# EAGLE design X15-DataConversion (EAGLE 9.6.2)
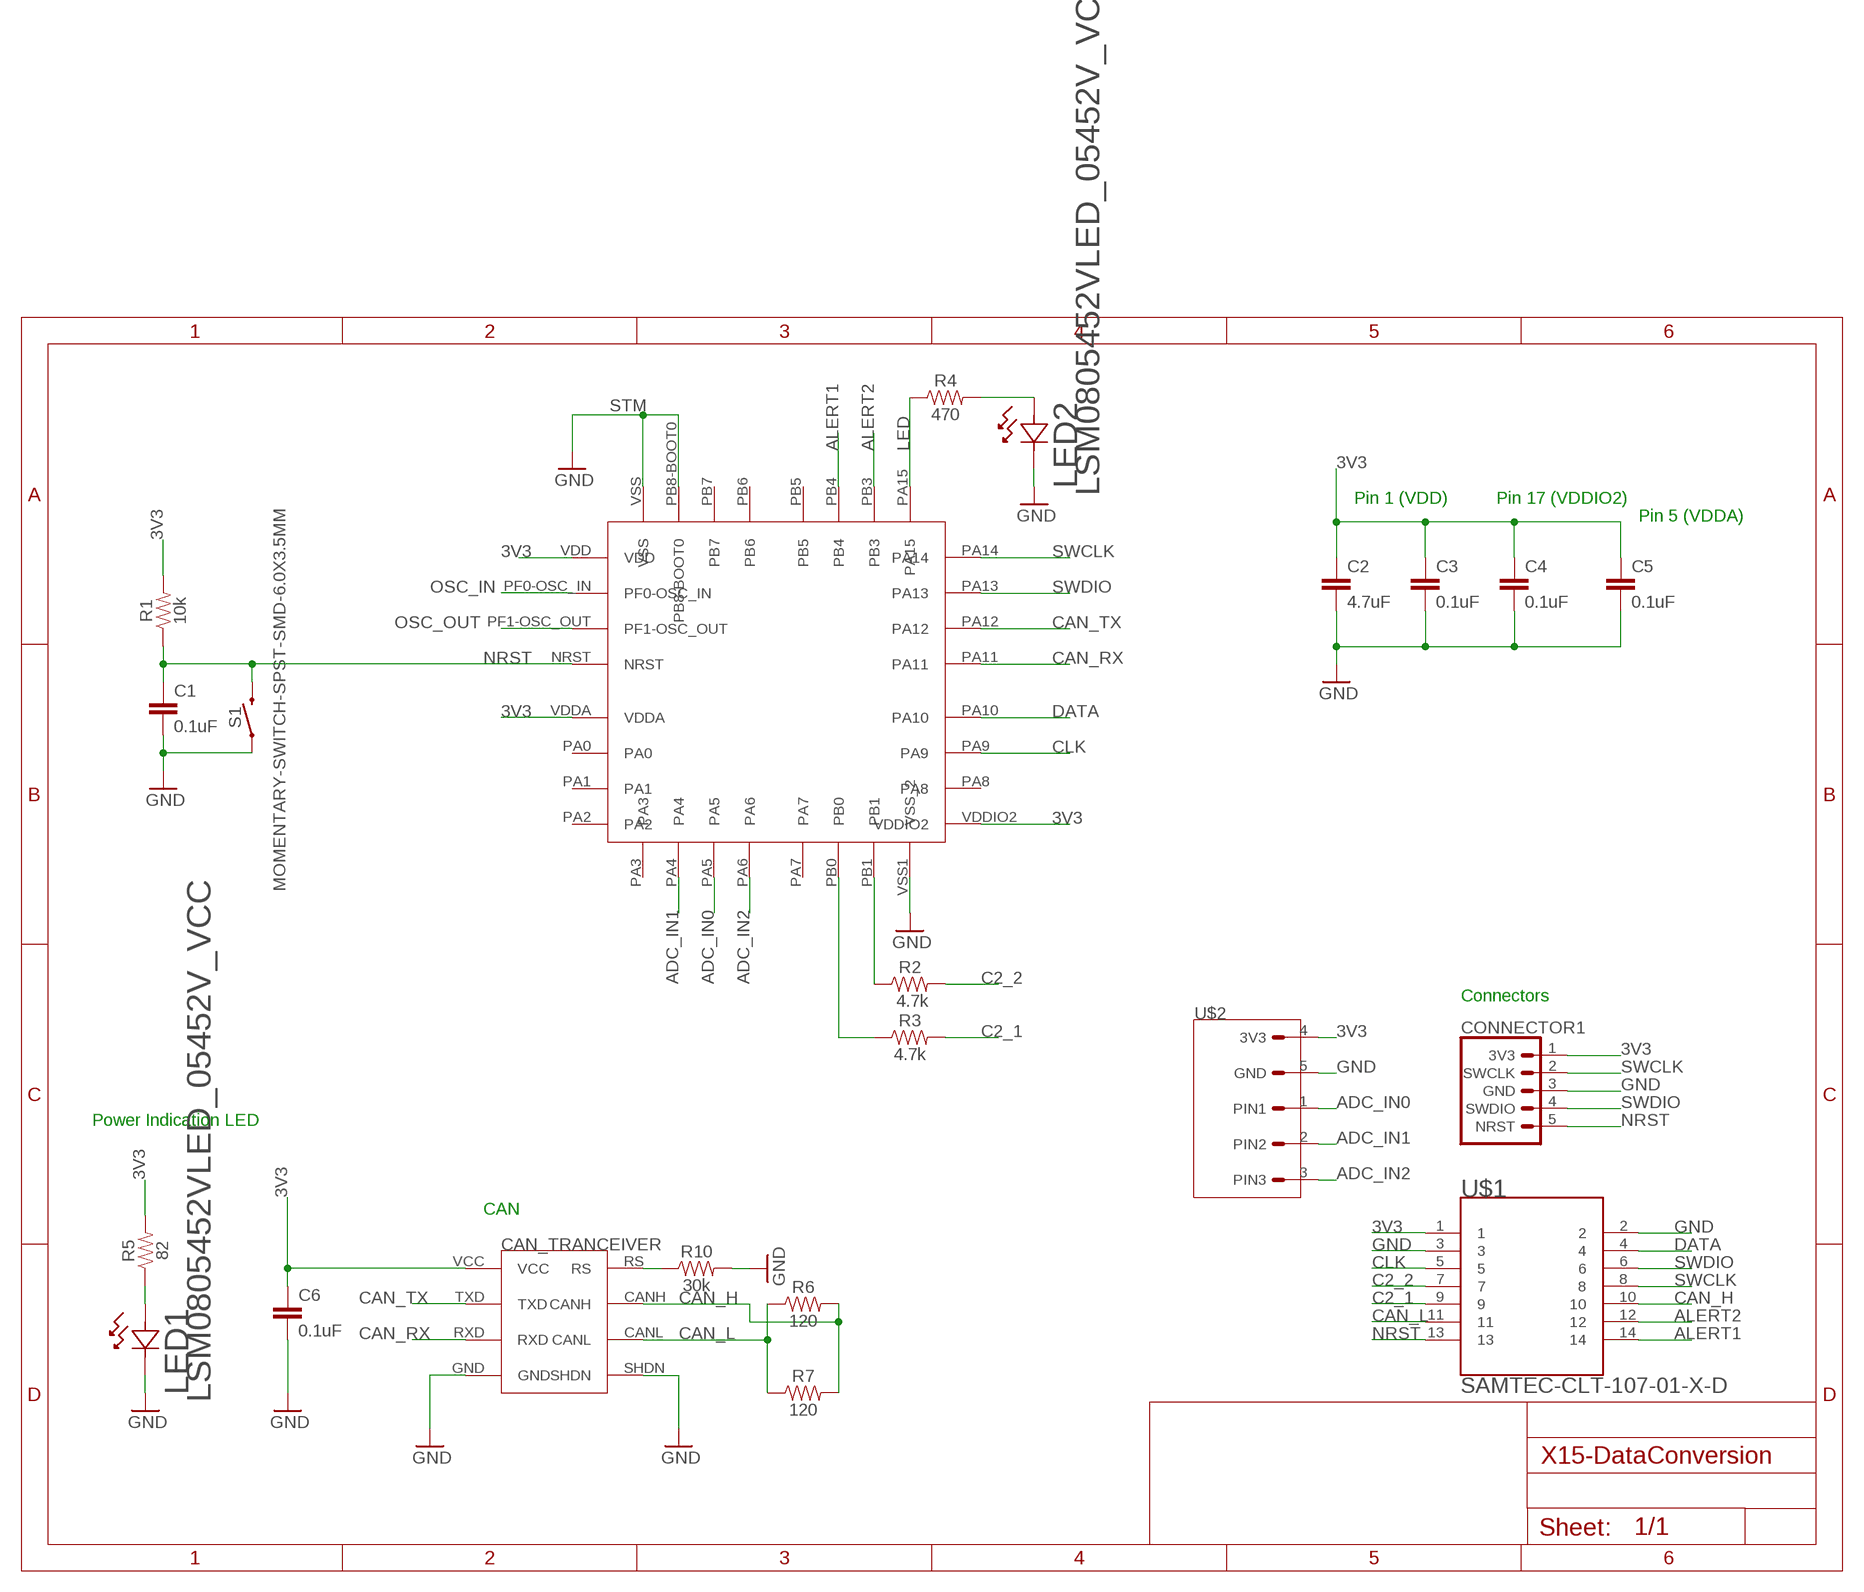
[diagram p0: schematic, sheet 1]

## Parts
C1  0.1uF  0.1UF-0603-25V-5%  [0603]
C2  4.7uF  0.1UF-0603-25V-5%  [0603]
C3  0.1uF  0.1UF-0603-25V-5%  [0603]
C4  0.1uF  0.1UF-0603-25V-5%  [0603]
C5  0.1uF  0.1UF-0603-25V-5%  [0603]
C6  0.1uF  0.1UF-0603-25V-5%  [0603]
CAN_TRANCEIVER  MAX3058ASA+  [MAX3058ASA+]
CONNECTOR1  3V3 -SWCLK-GND-SWDIO- NRST  SWD_CONN  [1X05]
LED1  LSM0805452VLED_05452V_VCC  [LED_05452V_VCC]
LED2  LSM0805452VLED_05452V_VCC  [LED_05452V_VCC]
R1  10k  RESISTOR0603  [0603]
R2  4.7k  RESISTOR0603  [0603]
R3  4.7k  RESISTOR0603  [0603]
R4  470  RESISTOR0603  [0603]
R5  82  RESISTOR0603  [0603]
R6  120  RESISTOR0603  [0603]
R7  120  RESISTOR0603  [0603]
R10  30k  RESISTOR0603  [0603]
S1  MOMENTARY-SWITCH-SPST-SMD-6.0X3.5MM  [TACTILE_SWITCH_SMD_6.0X3.5MM]
STM  STM32F042K6T6  [STM32F042K6T6]
U$1  BACKPLANE->DATACONV  [SAMTEC-CLT-107-01-X-D-BACKPLANE]
U$2  STM_CONN  [1X05]

## Nets
3V3: C2.1 C3.1 C4.1 C5.1 C6.1 CAN_TRANCEIVER.VCC CONNECTOR1.1(3V3) R1.2 R5.2 STM.VDD STM.VDDA STM.VDDIO2 U$1.1 U$2.4(3V3)
ADC_IN0: STM.PA5 U$2.1(PIN1)
ADC_IN1: STM.PA4 U$2.2(PIN2)
ADC_IN2: STM.PA6 U$2.3(PIN3)
ALERT1: STM.PB4 U$1.14
ALERT2: STM.PB3 U$1.12
C2_1: R3.2 U$1.9
C2_2: R2.2 U$1.7
CAN_H: CAN_TRANCEIVER.CANH R6.2 R7.2 U$1.10
CAN_L: CAN_TRANCEIVER.CANL R6.1 R7.1 U$1.11
CAN_RX: CAN_TRANCEIVER.RXD STM.PA11
CAN_TX: CAN_TRANCEIVER.TXD STM.PA12
CLK: STM.PA9 U$1.5
DATA: STM.PA10 U$1.4
GND: C1.2 C2.2 C3.2 C4.2 C5.2 C6.2 CAN_TRANCEIVER.GND CAN_TRANCEIVER.SHDN CONNECTOR1.3(GND) LED1.2 LED2.2 R10.2 S1.1 STM.PB8-BOOT0 STM.VSS STM.VSS1(VSS_2) U$1.2 U$1.3 U$2.5(GND)
LED: R4.1 STM.PA15
N$1: LED1.1 R5.1
N$2: CAN_TRANCEIVER.RS R10.1
N$6: R2.1 STM.PB1
N$7: R3.1 STM.PB0
N$11: LED2.1 R4.2
NRST: C1.1 CONNECTOR1.5(NRST) R1.1 S1.2 STM.NRST U$1.13
OSC_IN: STM.PF0-OSC_IN
OSC_OUT: STM.PF1-OSC_OUT
SWCLK: CONNECTOR1.2(SWCLK) STM.PA14 U$1.8
SWDIO: CONNECTOR1.4(SWDIO) STM.PA13 U$1.6
Unconnected: STM.PA0 STM.PA1 STM.PA2 STM.PA3 STM.PA7 STM.PA8 STM.PB5 STM.PB6 STM.PB7

## Notes on the sheet
- Pin 1 (VDD) | Pin 17 (VDDIO2)
- Pin 5 (VDDA)
- Connectors
- Power Indication LED
- CAN

## Library data of the parts
C1 C3-C6 = SparkFun-RF:0.1UF: 0.1µF ceramic capacitors A capacitor is a passive two-terminal electrical component used to store electrical energy temporarily in an electric field.; PROD_ID: CAP-08604
C2 = SparkFun-RF:0.1UF: 0.1µF ceramic capacitors A capacitor is a passive two-terminal electrical component used to store electrical energy temporarily in an electric field.; PROD_ID: CAP-08604; VALUE: 0.1uF
CAN_TRANCEIVER = X15-Data-Conversion-Parts:MAX3058ASA+
CONNECTOR1 = X15-Data-Conversion-Parts:SWD_CONN
LED1 LED2 = X15-Data-Conversion-Parts:LSM0805452V; COPYRIGHT: Copyright (C) 2022 Ultra Librarian. All rights reserved.; DIGI-KEY_PART_NUMBER_1: 28-LSM0805452VTR-ND; DIGI-KEY_PART_NUMBER_2: 28-LSM0805452VCT-ND; DIGI-KEY_PART_NUMBER_3: 28-LSM0805452VDKR-ND; MANUFACTURER_PART_NUMBER: LSM0805452V; MFR_NAME: VCC
R1-R7 R10 = SparkFun-Resistors:RESISTOR: Generic Resistor Package
S1 = SparkFun-Switches:MOMENTARY-SWITCH-SPST: Momentary Switch (Pushbutton) - SPST Normally-open (NO) SPST momentary switches (buttons, pushbuttons). Variants PTH-12MM - 12mm square, through-hole Momentary Pushbutton Switch - 12mm Square <https://www.sparkfun.com/products/9190> (COM-09190) PTH-6.0MM, PTH-6.0MM-KIT - 6.0mm square, through-hole Mini Pushbutton Switch <https://www.sparkfun.com/products/97> (COM-00097) KIT package intended for soldering kit's - only one side of pads' copper is exposed. PTH-RIGHT-ANGLE-KIT - Right-angle, through-hole Right Angle Tactile Button <https://www.sparkfun.com/products/10791> - Used on SparkFun BigTime Watch Kit <https://www.sparkfun.com/products/11734> SMD-12MM - 12mm square, surface-mount Tactile Button - SMD (12mm) <https://www.sparkfun.com/products/12993> (COM-12993) Used on SparkFun PicoBoard <https://www.sparkfun.com/products/11888> SMD-4.5MM - 4.5mm Square Trackball Switch Used on SparkFun Blackberry Trackballer Breakout <https://www.sparkfun.com/products/13169> SMD-4.6MMX2.8MM - 4.60mm x 2.80mm, surface mount Used on SparkFun Pro Micro - RP2040 <https://www.sparkfun.com/products/17717> SMD-5.2MM, SMD-5.2-REDUNDANT - 5.2mm square, surface-mount Mini Pushbutton Switch - SMD <https://www.sparkfun.com/products/8720> (COM-08720) Used on Arduino Pro Mini <https://www.sparkfun.com/products/11114> REDUNDANT package connects both switch circuits together SMD-6.0X3.5MM - 6.0 x 3.5mm, surface mount Momentary Reset Switch SMD <https://www.sparkfun.com/products/8229> (COM-08229) SMD-6.2MM-TALL - 6.2mm square, surface mount Tactile Button - SMD (6mm) <https://www.sparkfun.com/products/12992> Used on SparkFun Digital Sandbox <https://www.sparkfun.com/products/12651> SMD-RIGHT-ANGLE - Right-angle, surface mount Used on SparkFun Block for Intel® Edison - Arduino <https://www.sparkfun.com/products/13036>; PROD_ID: SWCH-14278; SF_SKU: COM-08229
STM = X15-Data-Conversion-Parts:STM32F042K6T6
U$1 = X15-Data-Conversion-Parts:BACKPLANE->DATACONV
U$2 = X15-Data-Conversion-Parts:STM_CONN

## Board
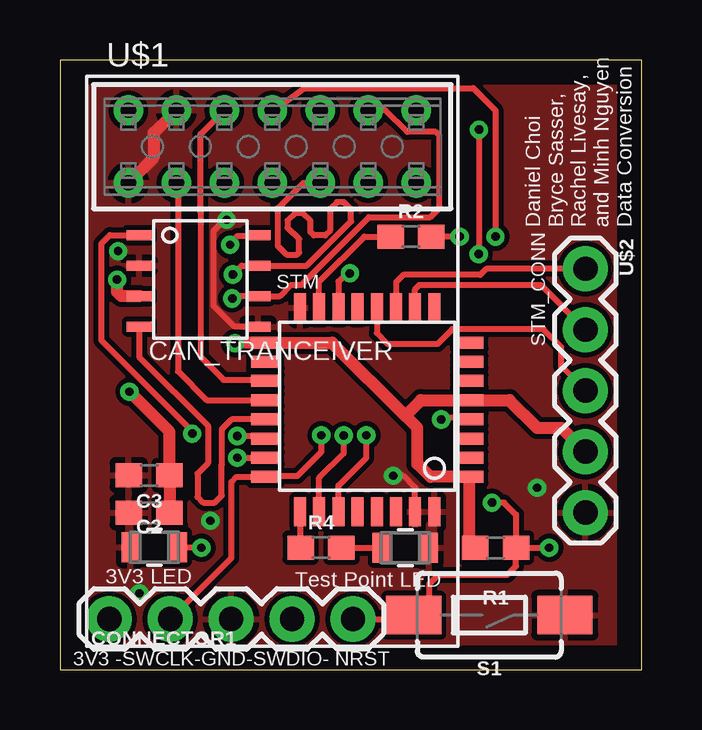
[diagram p1: board, top side]
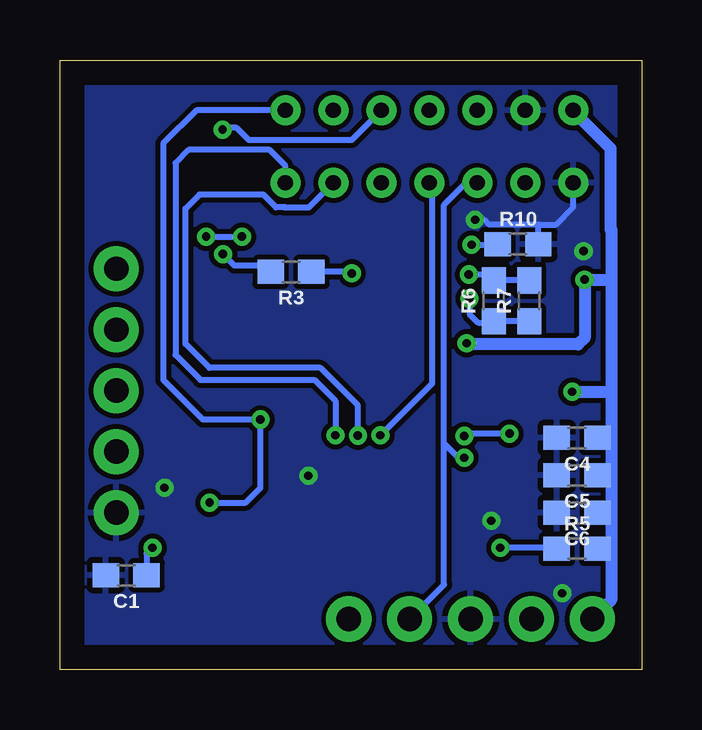
[diagram p2: board, bottom side, seen from below]

Size 24.26 x 25.4 mm. Coordinates in mm from the lower left corner, seen from the top.
Outline: 0,0 24.26,0 24.26,25.4 0,25.4 0,0
Copper layers (1*16): Top 0.035mm / dielectric 1.5mm / Bottom 0.035mm
Design rules "477": minimum track width 6mil, minimum drill 0.35mm, track to track 6mil, track to pad 6mil, pad to pad 6mil, via to via 6mil, smd to smd 6mil, copper to edge 40mil, drill to drill 6mil, minimum pad ring 10mil, minimum via ring 8mil, stop-mask expansion 4mil, vias tented up to drill 0mil, thermal gap 10mil

### Footprints (pad centres in the part's own frame; a part is rotated, then mirrored left to right if it is on the bottom)
0603 = smd 1.1 x 1: 1 -0.85,0; 2 0.85,0
MAX3058ASA+ = smd 1.05 x 0.42: CANH 4.95,-1.27; CANL 4.95,-2.54; GND 0,-1.27; RS 4.95,0; RXD 0,-3.81; SHDN 4.95,-3.81; TXD 0,0; VCC 0,-2.54
1X05 = drill 1.016 pad 1.88: 1 0,0; 2 2.54,0; 3 5.08,0; 4 7.62,0; 5 10.16,0
LED_05452V_VCC = smd 0.762 x 1.245: 1 -0.978,0; 2 0.978,0
TACTILE_SWITCH_SMD_6.0X3.5MM = smd 2.3 x 1.6: 1 -3.15,0; 2 3.15,0
STM32F042K6T6 = smd 1.2 x 0.5: NRST -1.45,4.65; PA0 -1.45,3.05; PA1 -1.45,2.25; PA2 -1.45,1.45; PA8 7.05,2.25; PA9 7.05,3.05; PA10 7.05,3.85; PA11 7.05,4.65; PA12 7.05,5.45; PA13 7.05,6.25; PA14 7.05,7.05; PF0-OSC_IN -1.45,6.25; PF1-OSC_OUT -1.45,5.45; VDD -1.45,7.05; VDDA -1.45,3.85; VDDIO2 7.05,1.45 | smd 0.5 x 1.2: PA3 0,0; PA4 0.8,0; PA5 1.6,0; PA6 2.4,0; PA7 3.2,0; PA15 5.6,8.5; PB0 4,0; PB1 4.8,0; PB3 4.8,8.5; PB4 4,8.5; PB5 3.2,8.5; PB6 2.4,8.5; PB7 1.6,8.5; PB8-BOOT0 0.8,8.5; VSS 5.6,0; VSS1 0,8.5
SAMTEC-CLT-107-01-X-D-BACKPLANE = drill 0.64 pad 1.24: 1 -6,1.511; 2 -6,-1.511; 3 -4,1.511; 4 -4,-1.511; 5 -2,1.511; 6 -2,-1.511; 7 0,1.511; 8 0,-1.511; 9 2,1.511; 10 2,-1.511; 11 4,1.511; 12 4,-1.511; 13 6,1.511; 14 6,-1.511

### Placement (x,y rotation side)
C1  21.5,3.94 180 bottom
C2  3.72,6.54 180 top
C3  3.72,8.1 180 top
C4  2.69,9.65 180 bottom
C5  2.69,8.1 180 bottom
C6  2.69,6.54 180 bottom
CAN_TRANCEIVER  3.31,18.1 0 top
CONNECTOR1  2.06,2.11 0 top
LED1  3.94,5.1 180 top
LED2  14.4,5.08 0 top
R1  18.16,5.08 180 top
R2  14.63,18.04 0 top
R3  14.62,16.58 180 bottom
R4  10.88,5.08 0 top
R5  2.69,5.03 0 bottom
R6  6.17,15.36 90 bottom
R7  4.69,15.36 90 bottom
R10  5.16,17.72 0 bottom
S1  17.9,2.27 180 top
STM  15.61,15.08 180 top
U$1  8.85,21.79 0 top
U$2  21.91,16.7 270 top

### Tracks (layer width: path | path; a pad name or v marks a point on that pad's centre or on a via)
3V3  (via drill 0.35)
  Top 0.508: R1.2 17.06,5.33 STM.VDD 15.45,8.03 14.9,8.58 14.9,10.08 14.4,10.58 | v7.3,13.6 7.33,13.63 STM.VDDIO2 11.35,13.63 14.4,10.58 | C2.1 C3.1 4.57,9.91 v2.9,11.58 | U$2.4 20.92,10.08 19.9,10.08 18.75,11.23 STM.VDDA 15.05,11.23 14.4,10.58 | CAN_TRANCEIVER.VCC 2.56,15.56 2.38,15.74 v2.38,16.25
  Bottom 0.508: CONNECTOR1.1 1.27,2.89 1.27,5.2 | 1.27,9.58 1.27,8.2 | 1.27,8.2 1.27,6.7 | 1.27,6.7 1.27,5.2 | R5.2 1.44,5.03 1.27,5.2 | C6.1 1.44,6.54 1.27,6.7 | C5.1 1.37,8.1 1.27,8.2 | C4.1 1.77,9.58 1.27,9.58 | v7.3,13.6 7.25,13.55 2.66,13.55 2.38,13.82 v2.38,16.25 1.36,16.25 1.27,16.33 | U$1.1 2.81,23.23 1.3,21.72 1.3,18.35 1.27,18.37 1.27,16.33 | 1.27,16.33 1.27,11.58 | 1.27,11.58 1.27,9.58 | v2.9,11.58 1.27,11.58
ADC_IN0
  Top 0.254: U$2.1 17.78,16.7 17.52,16.45 14.32,16.45 14.01,16.15 STM.PA5
ADC_IN1
  Top 0.254: STM.PA4 14.81,15.85 14.99,16.03 20.05,16.03 U$2.2
ADC_IN2
  Top 0.254: STM.PA6 13.21,14.03 13.67,13.58 15.75,13.58 16.36,14.19 20.16,14.19 20.9,13.45 20.9,12.63 U$2.3
ALERT1  (via drill 0.35)
  Top 0.254: STM.PB4 11.61,7.66 12.77,8.83 v12.77,9.76
  Bottom 0.254: v12.77,9.76 12.77,11.2 13.65,12.08 18.4,12.08 19.44,13.12 19.44,21.1 18.88,21.65 15.52,21.65 14.85,20.99 U$1.14
ALERT2  (via drill 0.35)
  Top 0.254: STM.PB3 10.81,7.99 11.84,9.01 v11.84,9.75
  Bottom 0.254: v11.84,9.75 11.84,11.01 13.4,12.58 18.02,12.58 19.02,13.58 19.02,19.21 18.44,19.79 15.77,19.79 15.25,19.26 14.9,19.26 14.82,19.26 13.88,19.26 U$1.12
C2_1  (via drill 0.35)
  Top 0.254: v17.46,17.31 17.48,17.33 v17.48,22.5
  Bottom 0.254: R3.2 15.74,16.84 16.99,16.84 v17.46,17.31 | U$1.9 12.08,22.08 16.39,22.08 16.89,22.58 17.4,22.58 v17.48,22.5
C2_2  (via drill 0.35)
  Top 0.203: v16.67,18.04 v16.66,18.04
  Top 0.254: v16.66,18.04 R2.2 | U$1.7 8.93,23.31 10.19,24.23 17.23,24.23 18.16,23.3 v18.16,18.04
  Bottom 0.254: v18.16,18.04 v16.67,18.04
CAN_H  (via drill 0.35)
  Top 0.254: v7.21,16.46 7.58,16.83 CAN_TRANCEIVER.CANH 10.29,16.83 12.14,18.68 12.14,19.18 11.84,19.48 11.54,19.48 11.28,19.22 11.28,18.31 11.06,18.09 10.58,18.09 10.44,18.24 10.44,18.72 10.13,19.02 9.79,19.02 9.49,18.72 9.49,18.42 9.74,18.16 9.75,18.16 9.97,17.95 9.97,17.37 9.89,17.29 9.44,17.29 9.08,17.65 9.08,19.23 9.09,19.23 10.15,20.28 U$1.10
  Bottom 0.254: R7.2 R6.2 6.43,16.48 7.19,16.48 v7.21,16.46
CAN_L  (via drill 0.35)
  Top 0.254: v7.18,15.46 7.28,15.56 CAN_TRANCEIVER.CANL 9.18,15.56 9.65,16.03 10.07,16.03 12.88,18.85 15.44,18.85 15.82,19.23 15.82,22.26 15.67,22.41 14.48,22.41 13.58,23.31 U$1.11
  Bottom 0.254: R7.1 R6.1 6.31,14.65 6.51,14.45 6.82,14.45 7.18,14.82 v7.18,15.46
CAN_RX
  Top 0.254: CAN_TRANCEIVER.RXD 3.31,13.02 6.17,10.16 6.17,8.6 5.74,8.17 5.74,7.2 5.97,6.96 6.45,6.96 6.74,7.25 6.74,8.55 6.74,10.01 7.16,10.43 STM.PA11
CAN_TX  (via drill 0.35)
  Top 0.254: STM.PA12 8.6,9.66 8.53,9.74 v7.4,9.74 | CAN_TRANCEIVER.TXD 2.07,18.1 1.72,17.75 1.72,13.71 5.51,9.92 v5.51,9.83
  Bottom 0.254: v5.51,9.83 7.3,9.83 v7.4,9.74
CLK
  Top 0.254: STM.PA9 8.51,12.08 6.82,12.08 5.86,13.04 5.86,19.08 5.86,19.2 5.86,22.31 U$1.5
DATA
  Top 0.254: STM.PA10 6.12,11.23 4.92,12.43 4.92,20.22 U$1.4
GND  (via drill 0.35)
  Top 0.254: STM.PB8-BOOT0 14.81,7.58 14.31,8.08 v13.9,8.08 | CAN_TRANCEIVER.SHDN 7.29,14.29 6.39,15.19 6.39,18.26 6.87,18.74 v6.95,18.74
  Top 0.508: U$1.3 3.9,22.35 3.9,21.33 U$1.2
  Bottom 0.254: 4.25,18.55 4.31,18.49 R10.2 | 4.25,18.55 3.59,18.55 2.85,19.28 U$1.2 | 4.25,18.55 6.37,18.55 6.56,18.74 v6.95,18.74
  other vias: 19.9,7.58 6.27,6.2 3.31,3.18 2.43,17.44
  pour Top (isolate 0.203): -2.1,28.08 25.9,28.08 27.9,26.08 27.9,0.08 25.9,-1.92 -2.1,-1.92 -4.1,0.08 -4.1,26.08
  pour Bottom (isolate 0.203): -2.1,28.08 23.9,28.08 25.9,26.08 25.9,-1.92 23.9,-3.92 -4.1,-3.92 -4.1,26.08
LED
  Top 0.254: R4.1 10.03,6.55 STM.PA15
N$1  (via drill 0.35)
  Top 0.254: v5.9,5.08 4.94,5.08 LED1.1
  Bottom 0.254: R5.1 3.59,5.08 v5.9,5.08
N$2  (via drill 0.35)
  Top 0.254: CAN_TRANCEIVER.RS 8.23,18.08 7.4,18.08 7.09,17.77 v7.09,17.7
  Bottom 0.254: R10.1 6.03,17.7 v7.09,17.7
N$6
  Top 0.254: STM.PB1 10.81,16.16 12.69,18.04 R2.1
N$7  (via drill 0.35)
  Top 0.254: STM.PB0 11.61,16.16 12.02,16.58 v12.09,16.51
  Bottom 0.203: 13.69,16.58 R3.1
  Bottom 0.254: v12.09,16.51 12.15,16.58 13.69,16.58
N$11
  Top 0.254: R4.2 LED2.1
NRST  (via drill 0.35)
  Top 0.254: CONNECTOR1.5 14.59,2.11 S1.2 15.4,2.92 15.4,3.58 15.77,3.95 18.65,3.95 19.01,4.32 R1.1 | STM.NRST 16.97,10.52 16,10.52 v15.9,10.42 | v18.02,6.96 18.52,6.96 19.01,6.46 R1.1 | R1.1 v20.41,5.08 v20.4,5.08
  Bottom 0.254: U$1.13 18.57,23.31 19.95,21.92 19.95,12.08 18.29,10.42 v15.9,10.42 15.9,7.58 16.51,6.96 v18.02,6.96 | v20.4,5.08 20.65,4.83 C1.1
SWCLK  (via drill 0.35)
  Top 0.254: CONNECTOR1.2 7.15,4.66 7.15,7.83 7.35,8.03 STM.PA14 8.61,8.08 9.9,8.08 10.9,9.08 v10.9,9.76
  Bottom 0.254: U$1.8 8.74,20.17 8.74,11.92 v10.9,9.76
SWDIO  (via drill 0.35)
  Top 0.254: v7.4,8.83 STM.PA13 | STM.PA13
  Bottom 0.254: CONNECTOR1.4 8.25,3.54 8.25,9.42 | 8.25,9.42 7.65,8.83 v7.4,8.83 | 8.25,9.42 8.25,19.37 7.33,20.28 U$1.6

### Text on the board
tPlace: Daniel Choi / Bryce Sasser, / Rachel Livesay, / and Minh Nguyen / Data Conversion
tNames: 3V3 LED | Test Point LED